# Altium schematic sheet Motor.SchDoc
size A4; SheetNumber: 6; SheetTotal: 11
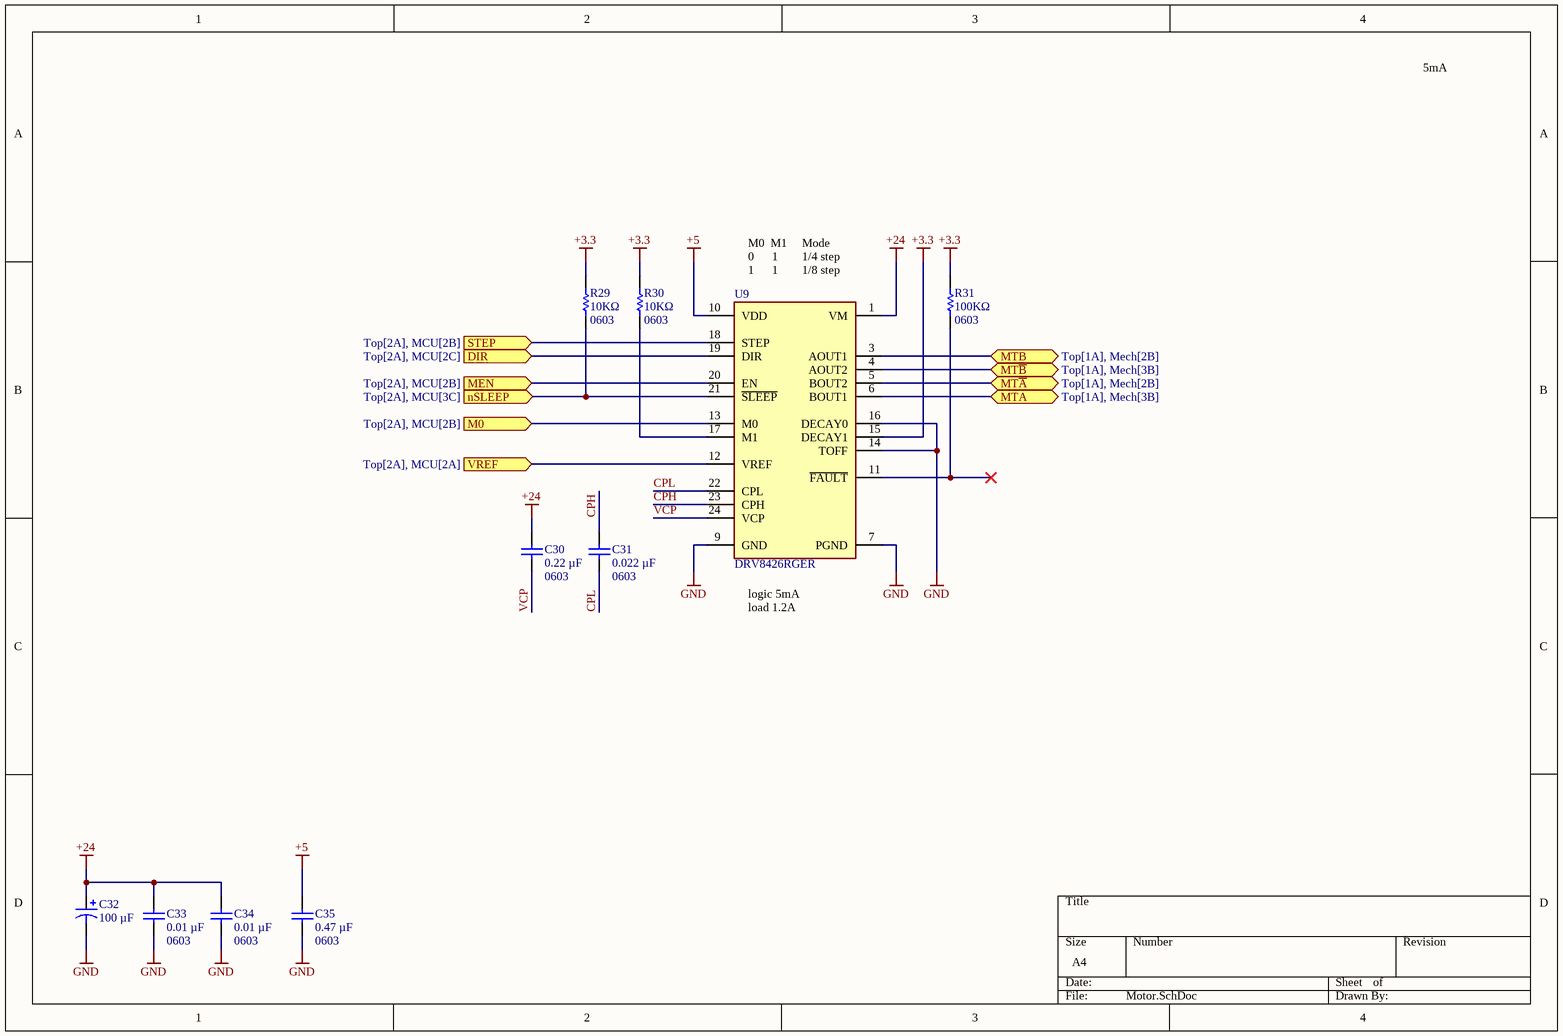
[diagram p0: Motor.SchDoc]

## Parts
C30  value 0.22 µF  [0603]  (hidden comment: GRM188R71H224KAC4D)
C31  value 0.022 µF  [0603]  (hidden comment: GRM188R72A223KAC4D)
C32  value 100 µF  [Radial 6.60x6.60]  (hidden comment: EEE-FTH101XAP)
C33  value 0.01 µF  [0603]  (hidden comment: GRM188R72A103KA01D)
C34  value 0.01 µF  [0603]  (hidden comment: GRM188R72A103KA01D)
C35  value 0.47 µF  [0603]  (hidden comment: GRM188R7YA474KE05D)
R29  value 10KΩ  [0603]  (hidden comment: RMCF0603FG10K0)
R30  value 10KΩ  [0603]  (hidden comment: RMCF0603FG10K0)
R31  value 100KΩ  [0603]  (hidden comment: RMCF0603FG100K)
U9  DRV8426RGER  [24-VQFN]

## Ports
DIR (in, see Top[2A], MCU[2C]), M0 (in, see Top[2A], MCU[2B]), MEN (in, see Top[2A], MCU[2B]), MTA (bidir, see Top[1A], Mech[3B]), MTB (bidir, see Top[1A], Mech[2B]), MT~{A} (bidir, see Top[1A], Mech[2B]), MT~{B} (bidir, see Top[1A], Mech[3B]), nSLEEP (in, see Top[2A], MCU[3C]), STEP (in, see Top[2A], MCU[2B]), VREF (in, see Top[2A], MCU[2A])

## Nets
+3.3: R29.2 R30.2 R31.1 U9.15(DECAY1)
+5: C35.2 U9.10(VDD)
+24: C30.2 C32.1 C33.2 C34.2 U9.1(VM)
GND: C32.2 C33.1 C34.1 C35.1 U9.7(PGND) U9.9(GND) U9.14(TOFF) U9.16(DECAY0)
CPH: C31.2 U9.23(CPH)
CPL: C31.1 U9.22(CPL)
DIR: U9.19(DIR) ; port DIR
M0: U9.13(M0) ; port M0
MEN: U9.20(EN) ; port MEN
MTA: U9.6(BOUT1) ; port MTA
MT~{A}: U9.5(BOUT2) ; port MT~{A}
MTB: U9.3(AOUT1) ; port MTB
MT~{B}: U9.4(AOUT2) ; port MT~{B}
nSLEEP: R29.1 U9.21(~{SLEEP}) ; port nSLEEP
STEP: U9.18(STEP) ; port STEP
VCP: C30.1 U9.24(VCP)
VREF: U9.12(VREF) ; port VREF
NetR30_1: R30.1 U9.17(M1)
NetR31_2: R31.2 U9.11(~{FAULT})

## Notes on the sheet
- 5mA
- (near U9) M0  M1     Mode
  0      1        1/4 step
  1      1        1/8 step
- (near U9) logic 5mA
  load 1.2A

## Library data of the parts
C30 = GRM188R71H224KAC4D: 0.22 µF ±10% 50V Ceramic Capacitor X7R 0603 (1608 Metric); Case: 0603; Tolerance: ±10%; Temperature Coefficient: X7R; Voltage: 50V
C31 = GRM188R72A223KAC4D: 0.022 µF ±10% 100V Ceramic Capacitor X7R 0603 (1608 Metric); Temperature Coefficient: X5R; Case: 0603; Tolerance: ±10%; Voltage: 100V
C32 = EEE-FTH101XAP: CAP ALUM 100UF 20% 50V SMD; Tolerance: ±20%; Voltage: 50V; Case: Radial
C33 C34 = GRM188R72A103KA01D: 0.01 µF ±10% 100V Ceramic Capacitor X7R 0603 (1608 Metric); Case: 0603; Tolerance: ±10%; Temperature Coefficient: X7R; Voltage: 100V
C35 = GRM188R7YA474KE05D: 0.47 µF ±10% 35V Ceramic Capacitor X7R 0603 (1608 Metric); Case: 0603; Tolerance: ±10%; Temperature Coefficient: X7R; Voltage: 35V
R29 R30 = RMCF0603FG10K0: 10 kOhms ±1% 0.1W, 1/10W Chip Resistor 0603 (1608 Metric) Automotive AEC-Q200 Thick Film; Case: 0603; Tolerance: 1%; Power: 0.1W
R31 = RMCF0603FG100K: 100 kOhms ±1% 0.1W, 1/10W Chip Resistor 0603 (1608 Metric) Automotive AEC-Q200 Thick Film; Case: 0603; Tolerance: 1%; Power: 0.1W
U9 = DRV8426RGER: Bipolar Motor Driver Power MOSFET Step/Direction 24-VQFN (4x4); pin to pad: 1>1+8 7>2+7